# Altium schematic sheet 脉冲延时.SchDoc
size A4
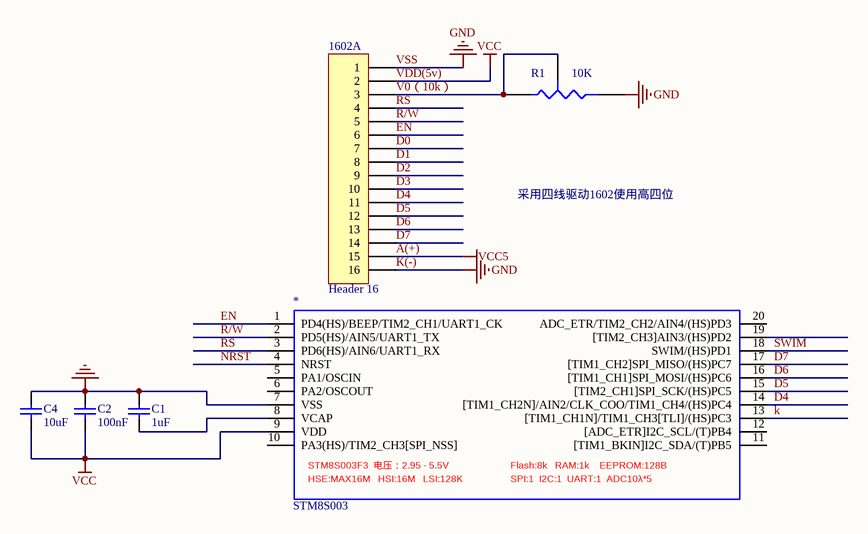
[diagram p0: 脉冲延时.SchDoc]

## Parts
1602A  Header 16  [HDR1X16]
*  STM8S003
C1  1uF  [0603C]
C2  100nF  [0603C]
C4  10uF  [0603C]
R1  value 10K  [VR3]  (hidden comment: Res Tap)

## Nets
A(+): 1602A.15  [also labelled VCC5]
K(-): 1602A.1 1602A.16 *.7(VSS) C1.2 C2.2 C4.2 R1.2(B)  [also labelled GND, VSS]
VDD(5v): 1602A.2 *.9(VDD) C2.1 C4.1  [also labelled VCC]
D0: 1602A.7
D1: 1602A.8
D2: 1602A.9
D3: 1602A.10
D4: 1602A.11 *.14([TIM1_CH2N]/AIN2/CLK_COO/TIM1_CH4/(HS)PC4)
D5: 1602A.12 *.15([TIM2_CH1]SPI_SCK/(HS)PC5)
D6: 1602A.13 *.16([TIM1_CH1]SPI_MOSI/(HS)PC6)
D7: 1602A.14 *.17([TIM1_CH2]SPI_MISO/(HS)PC7)
EN: 1602A.6 *.1(PD4(HS)/BEEP/TIM2_CH1/UART1_CK)
k: *.13([TIM1_CH1N]/TIM1_CH3[TLI]/(HS)PC3)
NRST: *.4(NRST)
R/W: 1602A.5 *.2(PD5(HS)/AIN5/UART1_TX)
RS: 1602A.4 *.3(PD6(HS)/AIN6/UART1_RX)
SWIM: *.18(SWIM/(HS)PD1)
V0（10k）: 1602A.3 R1.1(A) R1.3(TAP)
Net*_8: *.8(VCAP) C1.1

Not connected (* = marked no-connect by the designer): * 5(PA1/OSCIN) 6(PA2/OSCOUT) 10(PA3(HS)/TIM2_CH3[SPI_NSS]) 11([TIM1_BKIN]I2C_SDA/(T)PB5) 12([ADC_ETR]I2C_SCL/(T)PB4) 19([TIM2_CH3]AIN3/(HS)PD2) 20(ADC_ETR/TIM2_CH2/AIN4/(HS)PD3)

## Notes on the sheet
- 采用四线驱动1602使用高四位
- (in symbol STM8S003) STM8S003F3  电压：2.95 - 5.5V; Flash:8k   RAM:1k    EEPROM:128B; HSE:MAX16M   HSI:16M   LSI:128K; SPI:1  I2C:1  UART:1  ADC10λ*5

## Library data of the parts
1602A = Header 16: Header, 16-Pin; LatestRevisionDate: 17-Jul-2002; LatestRevisionNote: Re-released for DXP Platform.; Publisher: Altium Limited
C1 C2 C4 = Cap: Capacitor; Value: 100pF; Published: 8-Jun-2000; LatestRevisionDate: 17-Jul-2002; LatestRevisionNote: Re-released for DXP Platform.; PackageReference: RAD-0.3; Publisher: Altium Limited; PackageDescription: Radial Cap, Thru-Hole; 2 Leads; 0.3 in Pin Spacing
R1 = Res Tap: Tapped Resistor; Sim Note: Enter the Resistance value and the set point into parameter fields.; Set Position: 0.5; Published: 24-Mar-1999; LatestRevisionDate: 17-Jul-2002; LatestRevisionNote: Re-released for DXP Platform.; PackageReference: VR3; Publisher: Altium Limited